# EAGLE design auxDaqUnitTopDigital2022 - 2 (EAGLE 9.6.2)
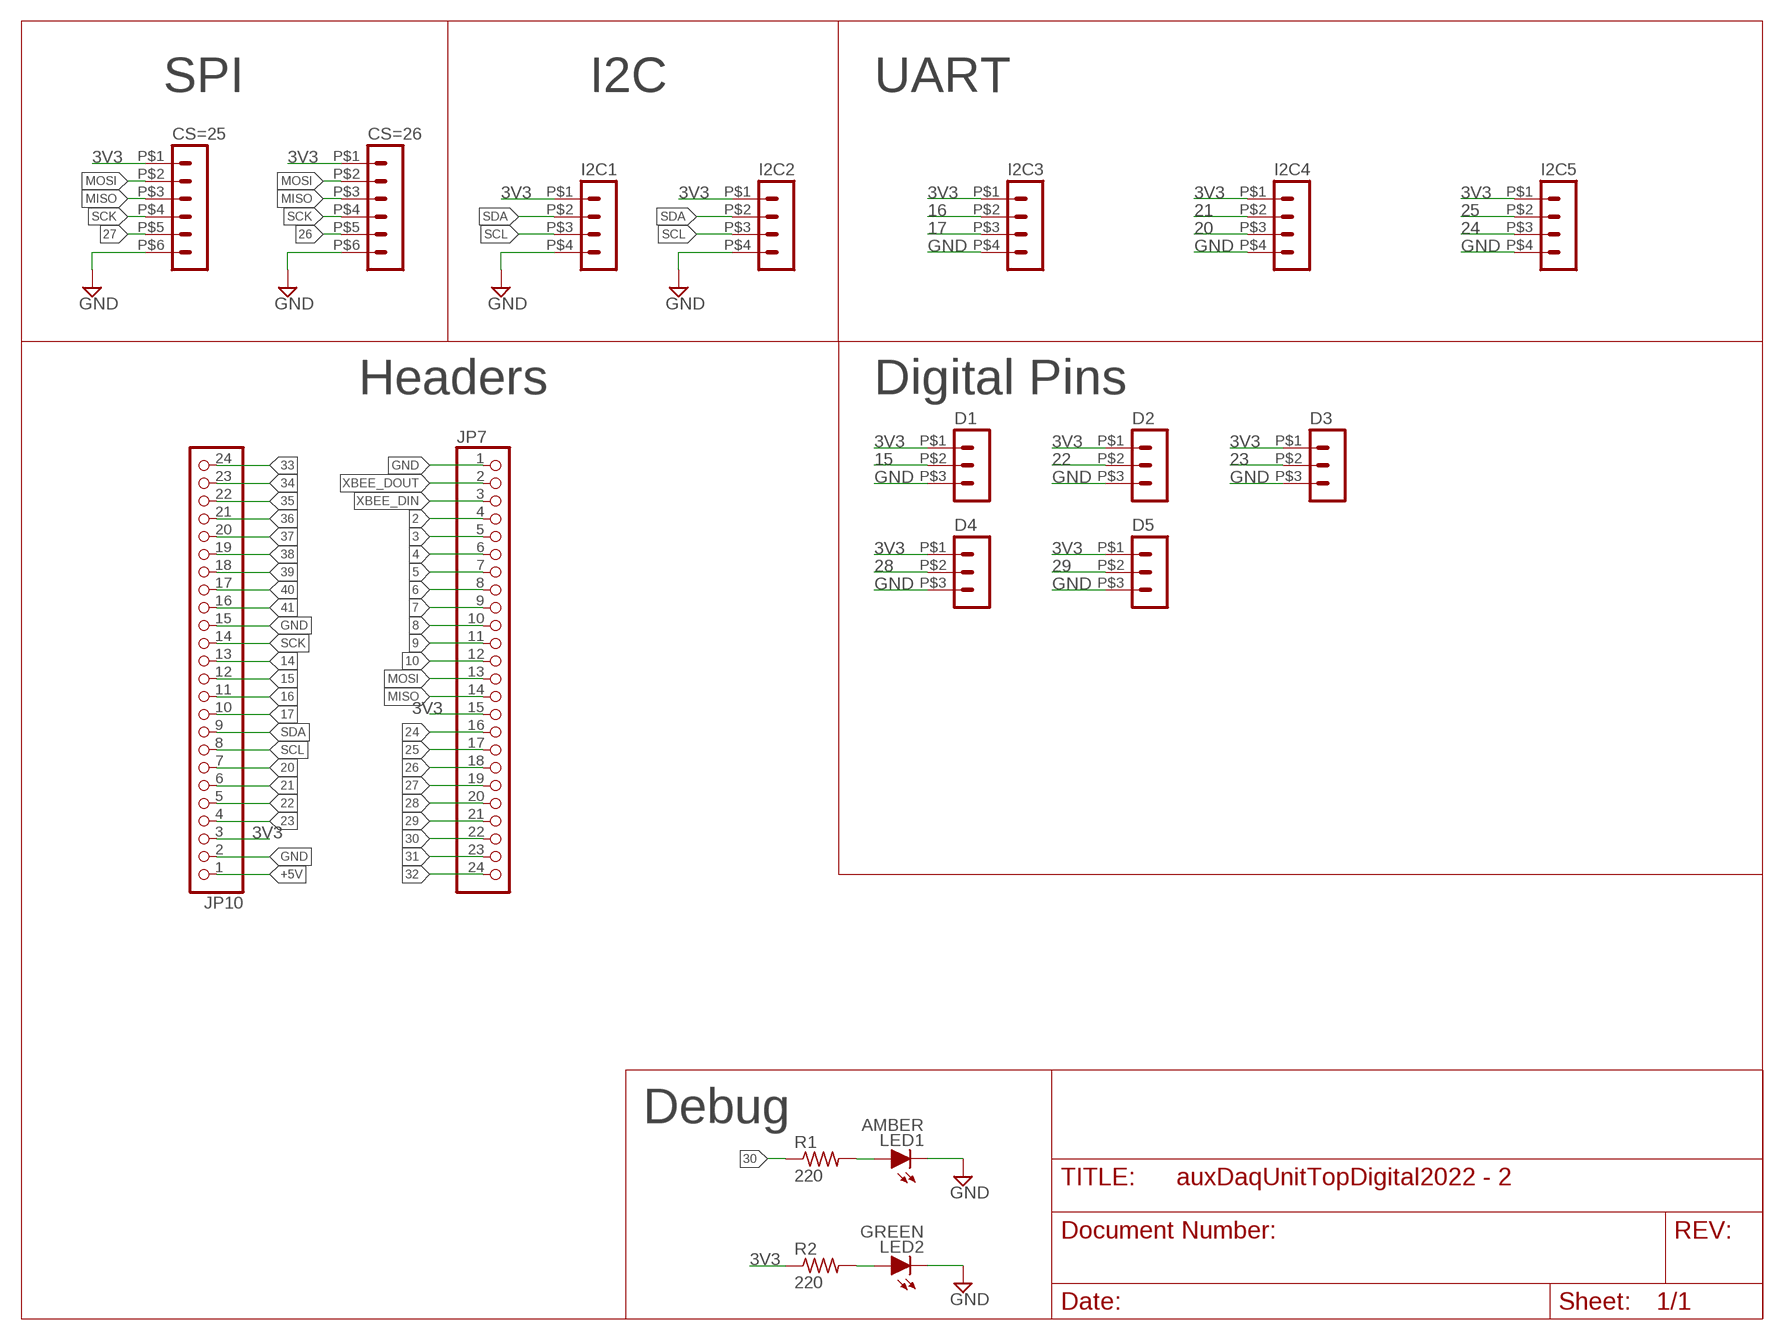
[diagram p0: schematic, sheet 1]
FRAME1 (LETTER_L): NAMEYEAR: PETER2022

## Parts
CS=25  HEADER_POS6_43045-0600  [43045-0600]
CS=26  HEADER_POS6_43045-0600  [43045-0600]
D1  HEADER_POS3_43650-0300  [43650-0300]
D2  HEADER_POS3_43650-0300  [43650-0300]
D3  HEADER_POS3_43650-0300  [43650-0300]
D4  HEADER_POS3_43650-0300  [43650-0300]
D5  HEADER_POS3_43650-0300  [43650-0300]
I2C1  HEADER_POS4_43045-0401  [43045-0400]
I2C2  HEADER_POS4_43045-0401  [43045-0400]
I2C3  HEADER_POS4_43045-0401  [43045-0400]
I2C4  HEADER_POS4_43045-0401  [43045-0400]
I2C5  HEADER_POS4_43045-0401  [43045-0400]
JP7  PINHD-1X24  [1X24]
JP10  PINHD-1X24  [1X24]
LED1  AMBER  LED-0603  [LED-603]
LED2  GREEN  LED-0603  [LED-603]
R1  220  RES_SMDR0603  [R0603]
R2  220  RES_SMDR0603  [R0603]

## Nets
2: JP7.4
3: JP7.5
3V3: CS=25.P$1 CS=26.P$1 D1.P$1 D2.P$1 D3.P$1 D4.P$1 D5.P$1 I2C1.P$1 I2C2.P$1 I2C3.P$1 I2C4.P$1 I2C5.P$1 JP7.15 JP10.3 R2.1
4: JP7.6
5: JP7.7
6: JP7.8
7: JP7.9
8: JP7.10
9: JP7.11
10: JP7.12
14: JP10.13
15: D1.P$2 JP10.12
16: I2C3.P$2 JP10.11
17: I2C3.P$3 JP10.10
20: I2C4.P$3 JP10.7
21: I2C4.P$2 JP10.6
22: D2.P$2 JP10.5
23: D3.P$2 JP10.4
24: I2C5.P$3 JP7.16
25: I2C5.P$2 JP7.17
26: CS=26.P$5 JP7.18
27: CS=25.P$5 JP7.19
28: D4.P$2 JP7.20
29: D5.P$2 JP7.21
30: JP7.22 R1.1
31: JP7.23
32: JP7.24
33: JP10.24
34: JP10.23
35: JP10.22
36: JP10.21
37: JP10.20
38: JP10.19
39: JP10.18
40: JP10.17
41: JP10.16
+5V: JP10.1
GND: CS=25.P$6 CS=26.P$6 D1.P$3 D2.P$3 D3.P$3 D4.P$3 D5.P$3 I2C1.P$4 I2C2.P$4 I2C3.P$4 I2C4.P$4 I2C5.P$4 JP7.1 JP10.2 JP10.15 LED1.C LED2.C
MISO: CS=25.P$3 CS=26.P$3 JP7.14
MOSI: CS=25.P$2 CS=26.P$2 JP7.13
N$1: LED1.A R1.2
N$2: LED2.A R2.2
SCK: CS=25.P$4 CS=26.P$4 JP10.14
SCL: I2C1.P$3 I2C2.P$3 JP10.8
SDA: I2C1.P$2 I2C2.P$2 JP10.9
XBEE_DIN: JP7.3
XBEE_DOUT: JP7.2

## Notes on the sheet
- SPI | I2C | UART
- Headers | Digital Pins
- Debug

## Library data of the parts
CS=25 CS=26 = GTOR - Microfit Connector:HEADER_POS6_?: Molex - Micro-Fit 3.0 Series connector, 3.00mm (0.118") pitch header, 6 positions.
D1-D5 = GTOR - Microfit Connector:HEADER_POS3_?: Molex - Micro-Fit 3.0 Series connector, 3.00mm (0.118") pitch header, 3 positions.
I2C1-I2C5 = GTOR - Microfit Connector:HEADER_POS4_?: Molex - Micro-Fit 3.0 Series connector, 3.00mm (0.118") pitch header, 4 positions.
JP7 JP10 = GTOR - Connectors:PINHD-1X24: PIN HEADER
LED1 LED2 = GTOR - Passive Components:LED: Light Emitting Diode (LED) Source: Dangerous Prototypes Eagle Library <https://github.com/DangerousPrototypes/Eagle_Part_Library>
R1 R2 = GTOR - Passive Components:RES_SMD: RESISTOR, American symbol; SPICEPREFIX: R

## Board
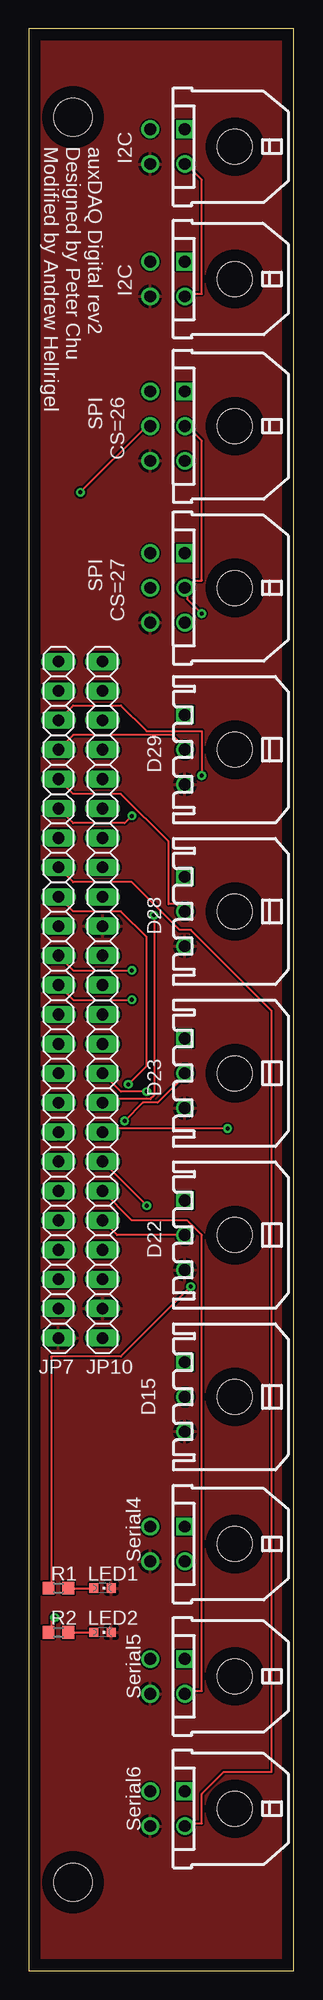
[diagram p1: board, top side]
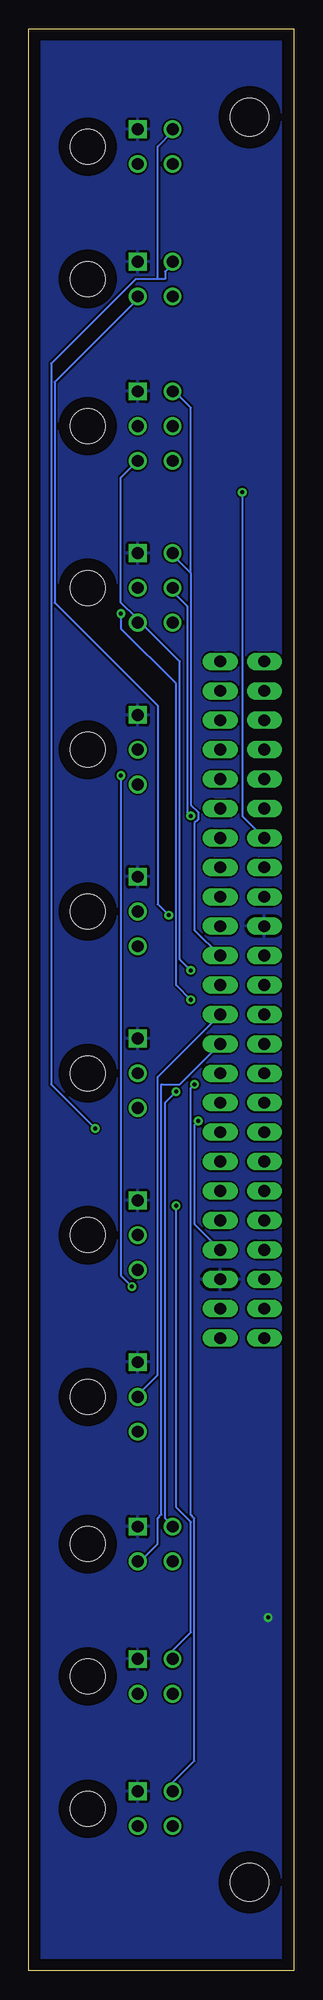
[diagram p2: board, bottom side, seen from below]

Size 22.86 x 167.64 mm. Coordinates in mm from the lower left corner, seen from the top.
Outline: 0,0 22.86,0 22.86,167.64 0,167.64 0,0
Copper layers (1*16): Top 0.035mm / dielectric 1.5mm / Bottom 0.035mm
Design rules "default": minimum track width 6mil, minimum drill 0.35mm, track to track 6mil, track to pad 6mil, pad to pad 6mil, via to via 6mil, smd to smd 6mil, copper to edge 40mil, drill to drill 6mil, minimum pad ring 10mil, minimum via ring 8mil, stop-mask expansion 4mil, vias tented up to drill 0mil, thermal gap 10mil
Holes 3.3 mm at 3.81,7.62 3.81,160.02

### Footprints (pad centres in the part's own frame; a part is rotated, then mirrored left to right if it is on the bottom)
43045-0600 = drill 1.02 square: P$1 3,4.32 | drill 1.02: P$2 0,4.32; P$3 -3,4.32; P$4 3,7.32; P$5 0,7.32; P$6 -3,7.32 | hole 3: 0,0
43650-0300 = drill 1.02 square: P$1 3,4.32 | drill 1.02: P$2 0,4.32; P$3 -3,4.32 | hole 3: 0,0
43045-0400 = drill 1.02 square: P$1 1.5,4.32 | drill 1.02: P$2 -1.5,4.32; P$3 1.5,7.32; P$4 -1.5,7.32 | hole 3: 0,0
1X24 = drill 1.016 long: 1 -29.21,0; 2 -26.67,0; 3 -24.13,0; 4 -21.59,0; 5 -19.05,0; 6 -16.51,0; 7 -13.97,0; 8 -11.43,0; 9 -8.89,0; 10 -6.35,0; 11 -3.81,0; 12 -1.27,0; 13 1.27,0; 14 3.81,0; 15 6.35,0; 16 8.89,0; 17 11.43,0; 18 13.97,0; 19 16.51,0; 20 19.05,0; 21 21.59,0; 22 24.13,0; 23 26.67,0; 24 29.21,0
LED-603 = smd 0.8 x 0.8: A 0,-0.75; C 0,0.75
R0603 = smd 1 x 1.1: 1 -0.85,0; 2 0.85,0

### Placement (x,y rotation side)
CS=25  17.78,119.38 90 top
CS=26  17.78,133.35 90 top
D1  17.78,49.53 90 top
D2  17.78,63.5 90 top
D3  17.78,77.47 90 top
D4  17.78,91.44 90 top
D5  17.78,105.41 90 top
I2C1  17.78,157.48 90 top
I2C2  17.78,146.05 90 top
I2C3  17.78,36.83 90 top
I2C4  17.78,25.4 90 top
I2C5  17.78,13.97 90 top
JP7  2.54,83.82 90 top
JP10  6.35,83.82 90 top
LED1  6.35,33.02 270 top
LED2  6.35,29.21 270 top
R1  2.54,33.02 0 top
R2  2.54,29.21 0 top

### Tracks (layer width: path | path; a pad name or v marks a point on that pad's centre or on a via)
3V3  (via drill 0.35)
  Top 0.152: v2.22,30.48 1.91,30.48 1.91,29.21 R2.1
  pour Bottom: -44.45,167.64 -44.45,-10.16 57.15,-10.16 57.15,167.64
15
  Bottom 0.152: JP10.12 11.75,77.15 11.75,51.44 13.33,49.85 13.33,49.53 D1.P$2
16
  Bottom 0.152: JP10.11 9.84,76.52 11.43,76.52 11.43,39.37 11.75,39.05 11.75,36.83 13.33,35.24 I2C3.P$2
17  (via drill 0.35)
  Top 0.152: JP10.10 7.94,75.88 v10.16,75.88
  Bottom 0.152: v10.16,75.88 11.11,74.93 11.11,39.05 10.48,38.42 I2C3.P$3
20  (via drill 0.35)
  Top 0.152: v10.16,66.04 JP10.7
  Bottom 0.152: v10.16,66.04 10.16,40.01 8.89,38.73 8.89,29.21 10.48,27.62 10.48,26.99 I2C4.P$3
21
  Top 0.152: JP10.6 8.89,64.77 13.65,64.77 14.92,63.5 14.92,24.13 13.65,24.13 I2C4.P$2
22
  Top 0.152: JP10.5 7.62,63.5 D2.P$2
23  (via drill 0.35)
  Top 0.152: v8.25,73.34 9.84,74.93 11.11,74.93 13.65,77.47 D3.P$2
  Bottom 0.152: JP10.4 8.57,64.45 8.57,73.03 v8.25,73.34
24  (via drill 0.35)
  Top 0.152: JP7.16 3.81,91.44 7.94,91.44 10.16,89.22 10.16,78.11 v8.57,76.52
  Bottom 0.152: v8.57,76.52 8.89,76.2 8.89,39.37 8.57,39.05 8.57,18.1 10.48,16.19 10.48,15.56 I2C5.P$3
25
  Top 0.152: JP7.17 3.81,93.98 8.89,93.98 13.02,89.85 13.97,89.85 20.95,82.87 20.95,17.14 16.83,17.14 14.92,15.24 14.92,12.7 13.65,12.7 I2C5.P$2
26  (via drill 0.35)
  Top 0.152: v4.44,127.64 10.16,133.35 CS=26.P$5
  Bottom 0.152: JP7.18 4.44,99.69 v4.44,127.64
27  (via drill 0.35)
  Top 0.152: JP7.19 3.81,99.06 8.25,99.06 v8.89,99.69
  Bottom 0.152: v8.89,99.69 9.21,100.01 9.21,117.79 10.16,118.75 10.16,119.38 CS=25.P$5
28
  Top 0.152: JP7.20 3.81,101.6 7.94,101.6 12.06,97.47 12.06,92.08 12.7,92.08 13.33,91.44 D4.P$2
29
  Top 0.152: JP7.21 3.81,106.68 12.38,106.68 13.65,105.41 D5.P$2
30  (via drill 0.35)
  Top 0.152: v13.97,59.05 7.94,53.02 1.91,53.02 1.91,33.02 R1.1 | v14.92,103.19 14.92,107 10.16,107 7.94,109.22 3.81,109.22 JP7.22
  Bottom 0.152: v13.97,59.05 14.92,60.01 v14.92,103.19
GND
  pour Top: 0,167.64 0,0 58.42,0 58.42,167.64
MISO  (via drill 0.35)
  Top 0.152: JP7.14 3.81,86.36 v8.89,86.36
  Bottom 0.152: CS=26.P$3 13.65,130.18 14.92,128.91 14.92,118.11 13.65,116.84 13.65,116.52 CS=25.P$3 13.33,116.52 9.84,113.03 9.84,87.31 v8.89,86.36
MOSI  (via drill 0.35)
  Top 0.152: v14.92,117.16 13.65,118.43 13.65,119.38 | 13.65,119.38 14.29,120.02 14.92,120.02 14.92,132.08 13.65,133.35 CS=26.P$2 | 13.65,119.38 CS=25.P$2 | JP7.13 3.81,83.82 v8.89,83.82
  Bottom 0.152: v14.92,117.16 14.92,115.89 10.16,111.12 10.16,85.09 v8.89,83.82
N$1
  Top 0.152: R1.2 LED1.A
N$2
  Top 0.152: R2.2 LED2.A
SCK
  Bottom 0.152: JP10.14 8.57,89.85 8.57,99.06 8.25,99.38 8.25,100.01 8.89,100.65 8.89,120.65 | 8.89,120.65 10.16,121.92 10.16,122.24 CS=25.P$4 | 8.89,120.65 8.89,134.94 10.16,136.21 CS=26.P$4
SCL  (via drill 0.35)
  Top 0.152: JP10.8 6.67,72.71 v17.14,72.71
  Bottom 0.152: v17.14,72.71 20.95,76.52 20.95,138.75 13.65,146.05 11.75,146.05 | 11.75,146.05 11.11,146.05 11.11,146.69 10.48,147.32 I2C2.P$3 | 11.75,146.05 11.75,157.48 10.48,158.75 I2C1.P$3
SDA  (via drill 0.35)
  Top 0.152: JP10.9 6.67,75.25 10.48,75.25 10.8,75.56 v10.8,91.12 | I2C1.P$2 13.65,155.89 14.92,154.62 14.92,144.78 13.65,144.78 I2C2.P$2
  Bottom 0.152: v10.8,91.12 11.75,92.08 11.75,109.22 20.64,118.11 20.64,137.16 13.65,144.15 13.65,144.46 I2C2.P$2

### Text on the board
tNames: I2C | auxDAQ Digital rev2 / Designed by Peter Chu / Modified by Andrew Hellrigel | I2C | SPI / CS=26 | SPI / CS=27 | D29 | D28 | D23 | D22 | D15 | Serial4 | Serial5 | Serial6
tValues: SPI